# Altium project USB Wi-Fi Radio.PrjPcb
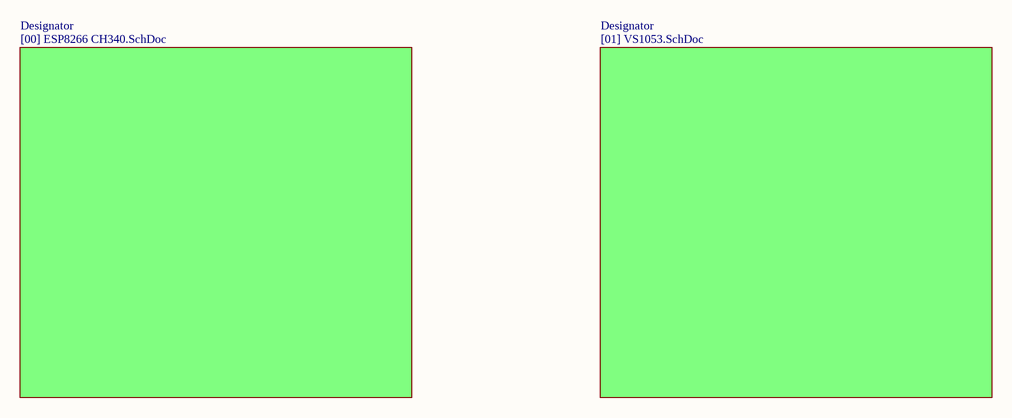
[diagram p0: Wi-Fi Radio.SchDoc]
3 sheets, 80 parts. Net scope: flat (ports and power ports of the same name join across sheets).
Board file: USB Wi-Fi.PcbDoc
Sheets:
  Wi-Fi Radio.SchDoc
    Designator = [00] ESP8266 CH340.SchDoc
    Designator = [01] VS1053.SchDoc

## Sheet Wi-Fi Radio.SchDoc
size A

### Sub-sheets
Designator = [00] ESP8266 CH340.SchDoc: no entries
Designator = [01] VS1053.SchDoc: no entries

## Sheet [00] ESP8266 CH340.SchDoc
size A4
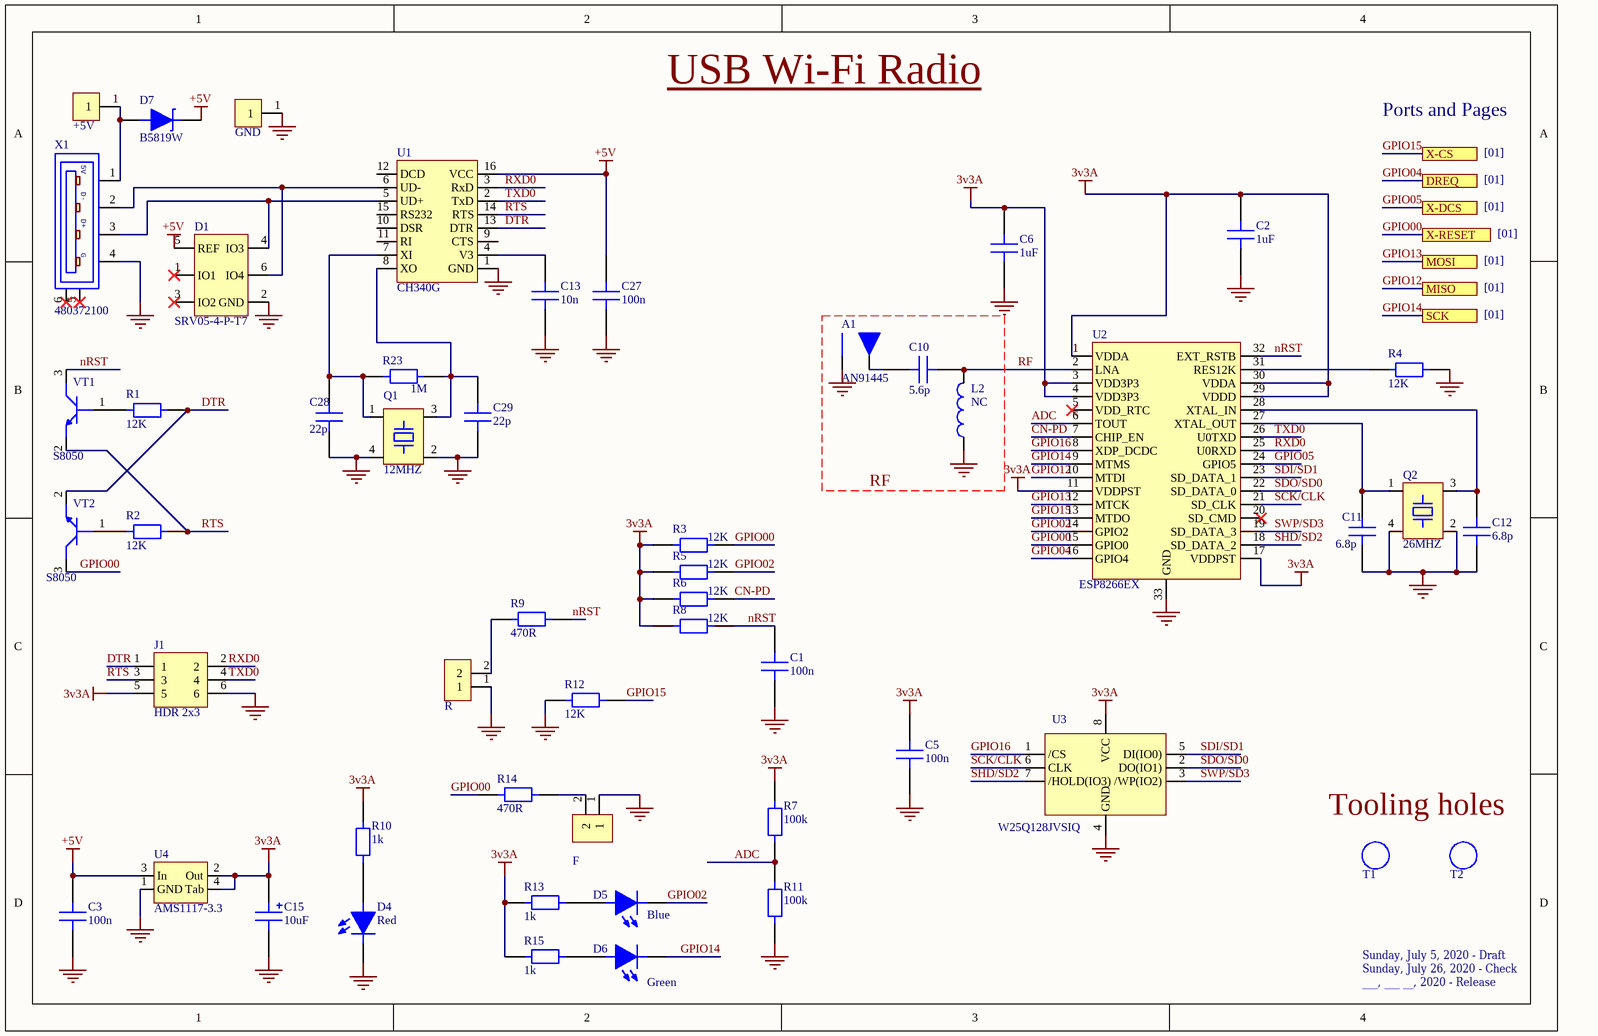
[diagram p1: [00] ESP8266 CH340.SchDoc]

### Parts
A1  AN91445  [MIFA 2.4GHz]  (no BOM)
C1  100n  [0603 CAP]
C2  1uF  [0402]
C3  100n  [0603 CAP]
C5  100n  [0603 CAP]
C6  1uF  [0402]
C10  5.6p  [CAP 0402]
C11  6.8p  [0402]
C12  6.8p  [0402]
C13  10n  [0603 CAP]
C15  10uF  [CAP 1206]
C27  100n  [0603 CAP]
C28  22p  [0603 CAP]
C29  22p  [0603 CAP]
D1  SRV05-4-P-T7  [SOT-23-6]
D4  Red  [LED 0603]
D5  Blue  [LED 0603]
D6  Green  [LED 0603]
D7  B5819W  [SOD-123]
J1  HDR 2x3  [HDR 2x3 2.54mm]
JP1  R  [Hdr_Fem_1x2_2.54mm]
JP2  F  [Hdr_Fem_1x2_2.54mm]
JP3  +5V  [Hdr_Fem_1x1_2.54mm]
JP4  GND  [Hdr_Fem_1x1_2.54mm]
L2  NC  [IND 0402]
Q1  12MHZ  [ABM8W]
Q2  26MHZ  [ABM8W]
R1  12K  [0603 RES]
R2  12K  [0603 RES]
R3  12K  [0603 RES]
R4  12K  [0402 RES]
R5  12K  [0603 RES]
R6  12K  [0603 RES]
R7  100k  [0603 RES]
R8  12K  [0603 RES]
R9  470R  [0603 RES]
R10  1k  [0603 RES]
R11  100k  [0603 RES]
R12  12K  [0603 RES]
R13  1k  [0603 RES]
R14  470R  [0603 RES]
R15  1k  [0603 RES]
R23  1M  [0603 RES]
T1  Tooling hole  [Tooling]  (value not drawn)  (no BOM)
T2  Tooling hole  [Tooling]  (value not drawn)  (no BOM)
U1  CH340G  [SOP-16]
U2  ESP8266EX  [QFN-32 Thermal]
U3  W25Q128JVSIQ  [SOIC-8 208-mil]
U4  AMS1117-3.3  [SOT233-3]
VT1  S8050  [SOT-23]
VT2  S8050  [SOT-23]
X1  480372100  [USB2.0-A]

### Ports
DREQ, MISO, MOSI, SCK, X-CS, X-DCS, X-RESET

### Nets
3v3A: C2.2 C5.1 C6.2 C15.1 J1.5 R3.1 R5.1 R6.1 R7.2 R8.1 R10.2 R13.1 R15.1 U2.1(VDDA) U2.3(VDD3P3) U2.4(VDD3P3) U2.11(VDDPST) U2.17(VDDPST) U2.29(VDDD) U2.30(VDDA) U3.8(VCC) U4.2(Out) U4.4(Tab)
+5V: C3.2 C27.2 D1.5(REF) D7.2(K) U1.16(VCC) U4.3(In)
GND: A1.2 C1.1 C2.1 C3.1 C5.2 C6.1 C11.1 C12.1 C13.1 C15.2 C27.1 C28.1 C29.1 D1.2(GND) D4.2 J1.6 JP1.1 JP2.1 JP4.1 L2.1 Q1.2(GND) Q1.4(GND) Q2.2(GND) Q2.4(GND) R4.2 R11.1 R12.1 U1.1(GND) U2.33(GND) U3.4(GND) U4.1(GND) X1.4(GND)
ADC: R7.1 R11.2 U2.6(TOUT)
CN-PD: R6.2 U2.7(CHIP_EN)
DTR: J1.1 R1.2 U1.13(DTR) VT2.2
GPIO00: R3.2 R14.1 U2.15(GPIO0) VT2.3 ; port X-RESET
GPIO02: D5.2 R5.2 U2.14(GPIO2)
GPIO04: U2.16(GPIO4) ; port DREQ
GPIO05: U2.24(GPIO5) ; port X-DCS
GPIO12: U2.10(MTDI) ; port MISO
GPIO13: U2.12(MTCK) ; port MOSI
GPIO14: D6.2 U2.9(MTMS) ; port SCK
GPIO15: R12.2 U2.13(MTDO) ; port X-CS
GPIO16: U2.8(XDP_DCDC) U3.1(/CS)
nRST: C1.2 R8.2 R9.2 U2.32(EXT_RSTB) VT1.3
RF: C10.2 L2.2 U2.2(LNA)
RTS: J1.3 R2.2 U1.14(RTS) VT1.2
RXD0: J1.2 U1.3(RxD) U2.25(U0RXD)
SCK/CLK: U2.21(SD_CLK) U3.6(CLK)
SDI/SD1: U2.23(SD_DATA_1) U3.5(DI(IO0))
SDO/SD0: U2.22(SD_DATA_0) U3.2(DO(IO1))
SHD/SD2: U2.18(SD_DATA_2) U3.7(/HOLD(IO3))
SWP/SD3: U2.19(SD_DATA_3) U3.3(/WP(IO2))
TXD0: J1.4 U1.2(TxD) U2.26(U0TXD)
NetA1_1: A1.1 C10.1
NetC11_2: C11.2 Q2.1 U2.27(XTAL_OUT)
NetC12_2: C12.2 Q2.3 U2.28(XTAL_IN)
NetC13_2: C13.2 U1.4(V3)
NetC28_2: C28.2 Q1.1 R23.1 U1.7(XI)
NetC29_2: C29.2 Q1.3 R23.2 U1.8(XO)
NetD1_4: D1.4(IO3) U1.5(UD+) X1.3(DX_P)
NetD1_6: D1.6(IO4) U1.6(UD-) X1.2(DX_N)
NetD4_1: D4.1 R10.1
NetD5_1: D5.1 R13.2
NetD6_1: D6.1 R15.2
NetD7_1: D7.1(A) JP3.1 X1.1(5V)
NetJP1_2: JP1.2 R9.1
NetJP2_2: JP2.2 R14.2
NetR1_1: R1.1 VT1.1
NetR2_1: R2.1 VT2.1
NetR4_1: R4.1 U2.31(RES12K)

Not connected (* = marked no-connect by the designer): D1 1(IO1)* 3(IO2)*; U1 9(CTS) 10(DSR) 11(RI) 12(DCD) 15(RS232); U2 5(VDD_RTC)* 20(SD_CMD)*; X1 5* 6*

### Notes on the sheet
- USB-TTL/Autoreset
- USB Wi-Fi Radio
- ESP8266EX
- Ports and Pages
- [01]
- RF
- I/O Bias
- Flash
- Power
- Tooling holes
- Sunday, ‎July ‎26, ‎2020 - Check
- Sunday, ‎July 5, ‎2020 - Draft
- ___, ‎___ ‎__, ‎2020 - Release
- (in symbol 480372100) D-; D+; G

### Library data of the parts
A1 = MIFA 2.4GHz: ComponentLink1Description: rf-layout-guidelines; ComponentLink1URL: https://www.cypress.com/documentation/application-notes/an91445-antenna-design-and-rf-layout-guidelines
C1 C3 C5 C27 = CC0603KRX7R9BB104: MULTILAYER CERAMIC CAPACITORS MLCC - SMD/SMT 100NF 50V 0603 ROHS; Manufacturer: YAGEO; Category: Capacitors; MFR.Part #: CC0603KRX7R9BB104; LCSC Part #: C14663; Package: 0603; Datasheet: https://datasheet.lcsc.com/szlcsc/YAGEO-CC0603KRX7R9BB104_C14663.pdf
C2 C6 = CL05A105KA5NQNC: MULTILAYER CERAMIC CAPACITORS MLCC - SMD/SMT 1UF 25V 0402 ROHS; Manufacturer: Samsung Electro-Mechanics; Category: Capacitors; MFR.Part #: CL05A105KA5NQNC; LCSC Part #: C52923; Package: 0402; Datasheet: https://datasheet.lcsc.com/szlcsc/Samsung-Electro-Mechanics-CL05A105KA5NQNC_C52923.pdf
C10 = CL05B103KB5NNNC_1: 5.6PF ±0.25PF 50V C0G 0402 MULTILAYER CERAMIC CAPACITORS MLCC - SMD/SMT ROHS; Manufacturer: Samsung Electro-Mechanics; MFR.Part #: CL05C5R6CB5NNNC; Library Type: Extended; Category: Capacitors; LCSC Part #: C318596; Package: 0402; Datasheet: https://datasheet.lcsc.com/szlcsc/1811131657_Samsung-Electro-Mechanics-CL05C5R6CB5NNNC_C318596.pdf; ComponentLink1Description: CL05C5R6CB5NNNC_C318596.pdf; ComponentLink1URL: https://datasheet.lcsc.com/szlcsc/1811131657_Samsung-Electro-Mechanics-CL05C5R6CB5NNNC_C318596.pdf
C11 C12 = 0402CG6R8C500NT: MULTILAYER CERAMIC CAPACITORS MLCC - SMD/SMT 6.8PF 50V 0402 ROHS; Manufacturer: Guangdong Fenghua Advanced Tech; Category: Capacitors; MFR.Part #: 0402CG6R8C500NT; LCSC Part #: C1576; Package: 0402; Datasheet: https://datasheet.lcsc.com/szlcsc/Guangdong-Fenghua-Advanced-Tech-0402CG6R8C500NT_C1576.pdf
C13 = 0603B103K500NT: MULTILAYER CERAMIC CAPACITORS MLCC - SMD/SMT 10NF 50V 0603 ROHS; Manufacturer: Guangdong Fenghua Advanced Tech; Category: Capacitors; MFR.Part #: 0603B103K500NT; LCSC Part #: C57112; Package: 0603; Datasheet: https://datasheet.lcsc.com/szlcsc/Guangdong-Fenghua-Advanced-Tech-0603B103K500NT_C57112.pdf
C15 = TAJA106K016RNJ: TANTALUM CAPACITORS 10UF 16V CASE-A_3216 ROHS; Manufacturer: AVX; Category: Capacitors; MFR.Part #: TAJA106K016RNJ; LCSC Part #: C7171; Package: CASE-A_3216; Datasheet: https://datasheet.lcsc.com/szlcsc/AVX-TAJA106K016RNJ_C7171.pdf
C28 C29 = CL10C220JB8NNNC: MULTILAYER CERAMIC CAPACITORS MLCC - SMD/SMT 22PF 50V 0603 ROHS; Manufacturer: Samsung Electro-Mechanics; Category: Capacitors; MFR.Part #: CL10C220JB8NNNC; LCSC Part #: C1653; Package: 0603; Datasheet: https://datasheet.lcsc.com/szlcsc/Samsung-Electro-Mechanics-CL10C220JB8NNNC_C1653.pdf
D1 = SRV05-4-P-T7: TVS SOT-23-6 ROHS; Manufacturer: ProTek Devices; Category: Diodes; MFR.Part #: SRV05-4-P-T7; LCSC Part #: C85364; Package: SOT-23-6L; Datasheet: https://datasheet.lcsc.com/szlcsc/ProTek-Devices-SRV05-4-P-T7_C85364.pdf; ComponentLink1Description: SRV05-4-P-T7_C85364; ComponentLink1URL: https://datasheet.lcsc.com/szlcsc/ProTek-Devices-SRV05-4-P-T7_C85364.pdf
D4 = KT-0603R: LIGHT EMITTING DIODES (LED) RED 520~625NM 90~100MCD@20MA TOP VIEW 0603 ROHS; Manufacturer: Hubei KENTO Elec; Category: LED's; MFR.Part #: KT-0603R; LCSC Part #: C2286; Package: LED_0603; Datasheet: https://datasheet.lcsc.com/szlcsc/Hubei-KENTO-Elec-KT-0603R_C2286.pdf
D5 = 19-217/BHC-ZL1M2RY/3T: LIGHT EMITTING DIODES (LED) BLUE 465~475NM 11.5~28.5MCD@5MA TOP VIEW 0603 ROHS; Manufacturer: Everlight Elec; Category: LED's; MFR.Part #: 19-217/BHC-ZL1M2RY/3T; LCSC Part #: C72041; Package: LED_0603; Datasheet: https://datasheet.lcsc.com/szlcsc/Everlight-Elec-19-217-BHC-ZL1M2RY-3T_C72041.pdf
D6 = 19-217/GHC-YR1S2/3T: LIGHT EMITTING DIODES (LED) GREEN 520~535NM 112~258MCD@20MA TOP VIEW 0603 ROHS; Manufacturer: Everlight Elec; Category: LED's; MFR.Part #: 19-217/GHC-YR1S2/3T; LCSC Part #: C72043; Package: LED_0603; Datasheet: https://datasheet.lcsc.com/szlcsc/Everlight-Elec-19-217-GHC-YR1S2-3T_C72043.pdf
D7 = B5819W: SCHOTTKY BARRIER DIODES (SBD) SOD-123 ROHS; Manufacturer: Changjiang Electronics Tech (CJ); Category: Diodes; MFR.Part #: B5819W; LCSC Part #: C8598; Package: SOD-123; Datasheet: https://datasheet.lcsc.com/szlcsc/Changjiang-Electronics-Tech-CJ-B5819W_C8598.pdf
J1 = 67997-106HLF: CONN HEADER 6POS .100 STR 30AU; Manufacturer 1: Amphenol FCI; Number of Contacts: 6; Insulation Resistance: 5GR; Max Voltage Rating (AC): 1.5kV; Gender: Male; Current Rating: 3A; Connector Type: Male Pin; Pitch: 2.54mm; Row Spacing: 0.1inch; Contact Post Length: 3.05mm; Supplier 1: Digi-Key; Manufacturer Part Number 1: 67997-106HLF; RoHS: Yes; Category: Headers and Wire Housings; Stock 1: 1665; Pricing 1: 1=1.78000, 10=1.61400, 100=1.38370, 500=1.15308, 1000=0.98835, 5000=0.87634, 10000=0.85657 (USD); Mount: Through Hole; Contact Plating: Gold,GXT; Housing Color: Black; Contact Material: Bronze; Color: Black; Housing Material: Thermoplastic; Min Operating Temperature: -65°C; Max Operating Temperature: 125°C; Termination: Through Hole; Number of Rows: 2; Orientation: Straight; Number of Positions: 6; Packaging: Bulk; Package Quantity: 100; Contact Gender: Male; Voltage Rating: 1.5kV; Length: 7.62mm; Contact Mating Length: 0.23inch; Depth: 4.83mm; Radiation Hardening: No; Lead Free: Lead Free; REACH SVHC: No SVHC; Flammability Rating: UL94 V-0; ComponentLink1URL: https://datasheet.ciiva.com/5153/67996-222463-5153820.pdf?src-supplier=Mouser; ComponentLink1Description: https://datasheet.ciiva.com/5153/67996-222463-5153820.pdf?src-supplier=Mouser; ComponentLink2URL: https://datasheet.ciiva.com/16726/67996-16726286.pdf?src-supplier=Avnet+Europe; ComponentLink2Description: https://datasheet.ciiva.com/16726/67996-16726286.pdf?src-supplier=Avnet+Europe; ComponentLink3URL: https://datasheet.ciiva.com/722/67996-722044.pdf?src-supplier=Digi-Key; ComponentLink3Description: https://datasheet.ciiva.com/722/67996-722044.pdf?src-supplier=Digi-Key; ComponentLink4URL: https://datasheet.ciiva.com/10149/67996-10149221.pdf?src-supplier=Avnet; ComponentLink4Description: https://datasheet.ciiva.com/10149/67996-10149221.pdf?src-supplier=Avnet; ComponentLink5URL: https://datasheet.ciiva.com/46393/1876884-46393067.pdf?src-supplier=Element14; ComponentLink5Description: https://datasheet.ciiva.com/46393/1876884-46393067.pdf?src-supplier=Element14; Supplier Part Number 1: 609-3393-ND
JP1 JP2 = 68602-204HLF: CONN HEADER VERT 2POS 2.54MM; Manufacturer 1: Amphenol FCI; Gender: Male; Connector Type: Male Pin; Number of Positions: 4; Insulation Resistance: 5GR; Current Rating: 3A; Voltage Rating: 1.5kV; Row Spacing: 0.1inch; Contact Post Length: 3.81mm; Supplier 1: Digi-Key; Manufacturer Part Number 1: 68602-204HLF; RoHS: Yes; Category: Headers and Wire Housings; Stock 1: 139; Pricing 1: 1=0.34000, 10=0.31900, 100=0.22320, 500=0.19132, 1000=0.15943, 5000=0.13665, 10000=0.12754 (USD); Mount: Through Hole; Housing Material: Thermoplastic; Contact Plating: Gold,GXT; Color: Black; Contact Material: Bronze; Min Operating Temperature: -65°C; Max Operating Temperature: 125°C; Termination: Solder; Packaging: Bulk; Number of Rows: 2; Number of Contacts: 4; Package Quantity: 100; Contact Gender: Male; Pitch: 2.54mm; Contact Mating Length: 0.23inch; Radiation Hardening: No; Flammability Rating: UL94 V-0; ComponentLink1URL: https://datasheet.ciiva.com/728/67996-728884.pdf?src-supplier=Digi-Key; ComponentLink1Description: https://datasheet.ciiva.com/728/67996-728884.pdf?src-supplier=Digi-Key; Supplier Part Number 1: 609-3369-ND
JP3 JP4 = 68602-101HLF: CONN HEADER VERT 1POS 2.54MM; Manufacturer 1: Amphenol FCI; Manufacturer Part Number 1: 68602-204HLF; Gender: Male; Connector Type: Male Pin; Number of Positions: 4; Insulation Resistance: 5GR; Current Rating: 3A; Voltage Rating: 1.5kV; Row Spacing: 0.1inch; Contact Post Length: 3.81mm; Supplier 1: Digi-Key; RoHS: Yes; Category: Headers and Wire Housings; Stock 1: 139; Pricing 1: 1=0.34000, 10=0.31900, 100=0.22320, 500=0.19132, 1000=0.15943, 5000=0.13665, 10000=0.12754 (USD); Mount: Through Hole; Housing Material: Thermoplastic; Contact Plating: Gold,GXT; Color: Black; Contact Material: Bronze; Min Operating Temperature: -65°C; Max Operating Temperature: 125°C; Termination: Solder; Packaging: Bulk; Number of Rows: 2; Number of Contacts: 4; Package Quantity: 100; Contact Gender: Male; Pitch: 2.54mm; Contact Mating Length: 0.23inch; Radiation Hardening: No; Flammability Rating: UL94 V-0; ComponentLink1URL: https://datasheet.ciiva.com/728/67996-728884.pdf?src-supplier=Digi-Key; ComponentLink1Description: https://datasheet.ciiva.com/728/67996-728884.pdf?src-supplier=Digi-Key; Supplier Part Number 1: 609-3369-ND
L2 = NC IND: IND 0402 Matching
Q1 = X322512MSB4SI: SMD CRYSTAL RESONATORS 12MHZ ±10PPM SMD-3225_4P ROHS; Manufacturer: Yangxing Tech; Category: Crystals; MFR.Part #: X322512MSB4SI; LCSC Part #: C9002; Package: SMD-3225_4P; Datasheet: https://datasheet.lcsc.com/szlcsc/Yangxing-Tech-X322512MSB4SI_C9002.pdf; ComponentLink1Description: X322512MSB4SI_C9002.pdf; ComponentLink1URL: https://datasheet.lcsc.com/szlcsc/Yangxing-Tech-X322512MSB4SI_C9002.pdf
Q2 = X322526MEB4SC: SMD CRYSTAL RESONATORS 26MHZ ±10PPM SMD-3225_4P ROHS; Manufacturer: Yangxing Tech; Category: Crystals; MFR.Part #: X322526MEB4SC; LCSC Part #: C23425; Package: SMD-3225_4P; Datasheet: https://datasheet.lcsc.com/szlcsc/Yangxing-Tech-X322526MEB4SC_C23425.pdf
R1-R3 R5 R6 R8 R12 = 0603WAF1202T5E: CHIP RESISTOR - SURFACE MOUNT 12KOHMS ±1% 1/10W 0603 ROHS; Manufacturer: Uniroyal Elec; Category: Resistors; MFR.Part #: 0603WAF1202T5E; LCSC Part #: C22790; Package: 0603; Datasheet: https://datasheet.lcsc.com/szlcsc/Uniroyal-Elec-0603WAF1202T5E_C22790.pdf
R4 = 0402WGF1202TCE: CHIP RESISTOR - SURFACE MOUNT 12KOHMS ±1% 1/16W 0402 ROHS; Manufacturer: Uniroyal Elec; Category: Resistors; MFR.Part #: 0402WGF1202TCE; LCSC Part #: C25752; Package: 0402; Datasheet: https://datasheet.lcsc.com/szlcsc/Uniroyal-Elec-0402WGF1202TCE_C25752.pdf
R7 R11 = 0603WAF1003T5E: CHIP RESISTOR - SURFACE MOUNT 100KOHMS ±1% 1/10W 0603 ROHS; Manufacturer: Uniroyal Elec; Category: Resistors; MFR.Part #: 0603WAF1003T5E; LCSC Part #: C25803; Package: 0603; Datasheet: https://datasheet.lcsc.com/szlcsc/Uniroyal-Elec-0603WAF1003T5E_C25803.pdf
R9 R14 = 0603WAF4700T5E: CHIP RESISTOR - SURFACE MOUNT 470OHMS ±1% 1/10W 0603 ROHS; Manufacturer: Uniroyal Elec; Category: Resistors; MFR.Part #: 0603WAF4700T5E; LCSC Part #: C23179; Package: 0603; Datasheet: https://datasheet.lcsc.com/szlcsc/Uniroyal-Elec-0603WAF4700T5E_C23179.pdf
R10 R13 R15 = 0603WAF1001T5E: CHIP RESISTOR - SURFACE MOUNT 1KOHMS ±1% 1/10W 0603 ROHS; Manufacturer: Uniroyal Elec; Category: Resistors; MFR.Part #: 0603WAF1001T5E; LCSC Part #: C21190; Package: 0603; Datasheet: https://datasheet.lcsc.com/szlcsc/Uniroyal-Elec-0603WAF1001T5E_C21190.pdf
R23 = 0603WAF1004T5E: CHIP RESISTOR - SURFACE MOUNT 1MOHMS ±1% 1/10W 0603 ROHS; Manufacturer: Uniroyal Elec; Category: Resistors; MFR.Part #: 0603WAF1004T5E; LCSC Part #: C22935; Package: 0603; Datasheet: https://datasheet.lcsc.com/szlcsc/Uniroyal-Elec-0603WAF1004T5E_C22935.pdf
T1 T2 = Tooling hole: For JLCPCB SMT Assembly
U1 = CH340G: USB 2MBPS 3.3V, 5V SOP-16_150MIL ROHS; Manufacturer: Jiangsu Qin Heng; Category: IC's; MFR.Part #: CH340G; LCSC Part #: C14267; Package: SOIC-16_3.9x9.9x1.27P; Datasheet: https://datasheet.lcsc.com/szlcsc/Jiangsu-Qin-Heng-CH340G_C14267.pdf
U2 = ESP8266EX: RF TRANSCEIVER ICS TXRX + MCU WIFI 802.11B/G/N/E/I 2.4GHZ 16DBM - 91DBM 2.5V~3.6V QFN-32_5X5X05P ROHS; Manufacturer: Espressif Systems; Library Type: Extended; Category: IC's; MFR.Part #: ESP8266EX; LCSC Part #: C77967; Package: QFN-32_EP_5.0x5.0x0.5P; Datasheet: https://datasheet.lcsc.com/szlcsc/Espressif-Systems-ESP8266EX_C77967.pdf
U3 = W25Q128JVSIQ: FLASH FLASH 128MB (16M X 8) SPI - DUAL/QUAD I/O SOIC-8_208MIL ROHS; Manufacturer: Winbond Elec; Category: IC's; MFR.Part #: W25Q128JVSIQ; LCSC Part #: C97521; Package: SOIC-8_5.3x5.3x1.27P; Datasheet: https://datasheet.lcsc.com/szlcsc/Winbond-Elec-W25Q128JVSIQTR_C97521.pdf
U4 = AMS1117-3.3: LOW DROPOUT REGULATORS(LDO) POSITIVE FIXED 1.3V @ 800MA 15V 3.3V 1A SOT-223 ROHS; Manufacturer: Advanced Monolithic Systems; Category: IC's; MFR.Part #: AMS1117-3.3; LCSC Part #: C6186; Package: SOT-223; Datasheet: https://datasheet.lcsc.com/szlcsc/1811201117_Advanced-Monolithic-Systems-AMS-AMS1117-3-3_C6186.pdf; ComponentLink1Description: AMS1117-3-3_C6186; ComponentLink1URL: https://datasheet.lcsc.com/szlcsc/1811201117_Advanced-Monolithic-Systems-AMS-AMS1117-3-3_C6186.pdf
VT1 VT2 = S8050: TRANSISTORS (NPN/PNP) NPN 500MA 25V SOT-23(SOT-23-3) ROHS; Manufacturer: Changjiang Electronics Tech (CJ); Category: Transistors; MFR.Part #: S8050; LCSC Part #: C2146; Package: SOT-23-3; Datasheet: https://datasheet.lcsc.com/szlcsc/Changjiang-Electronics-Tech-CJ-S8050_C2146.pdf
X1 = 480372100: USB - Type A Male USB 2 4 Through Hole USB Connectors RoHS; Manufacturer: MOLEX; Category: Connectors; MFR.Part #: 480372100; LCSC Part #: C136453; Package: Through Hole; Datasheet: https://datasheet.lcsc.com/szlcsc/1811131824_MOLEX-480372100_C136453.pdf

## Sheet [01] VS1053.SchDoc
size A4
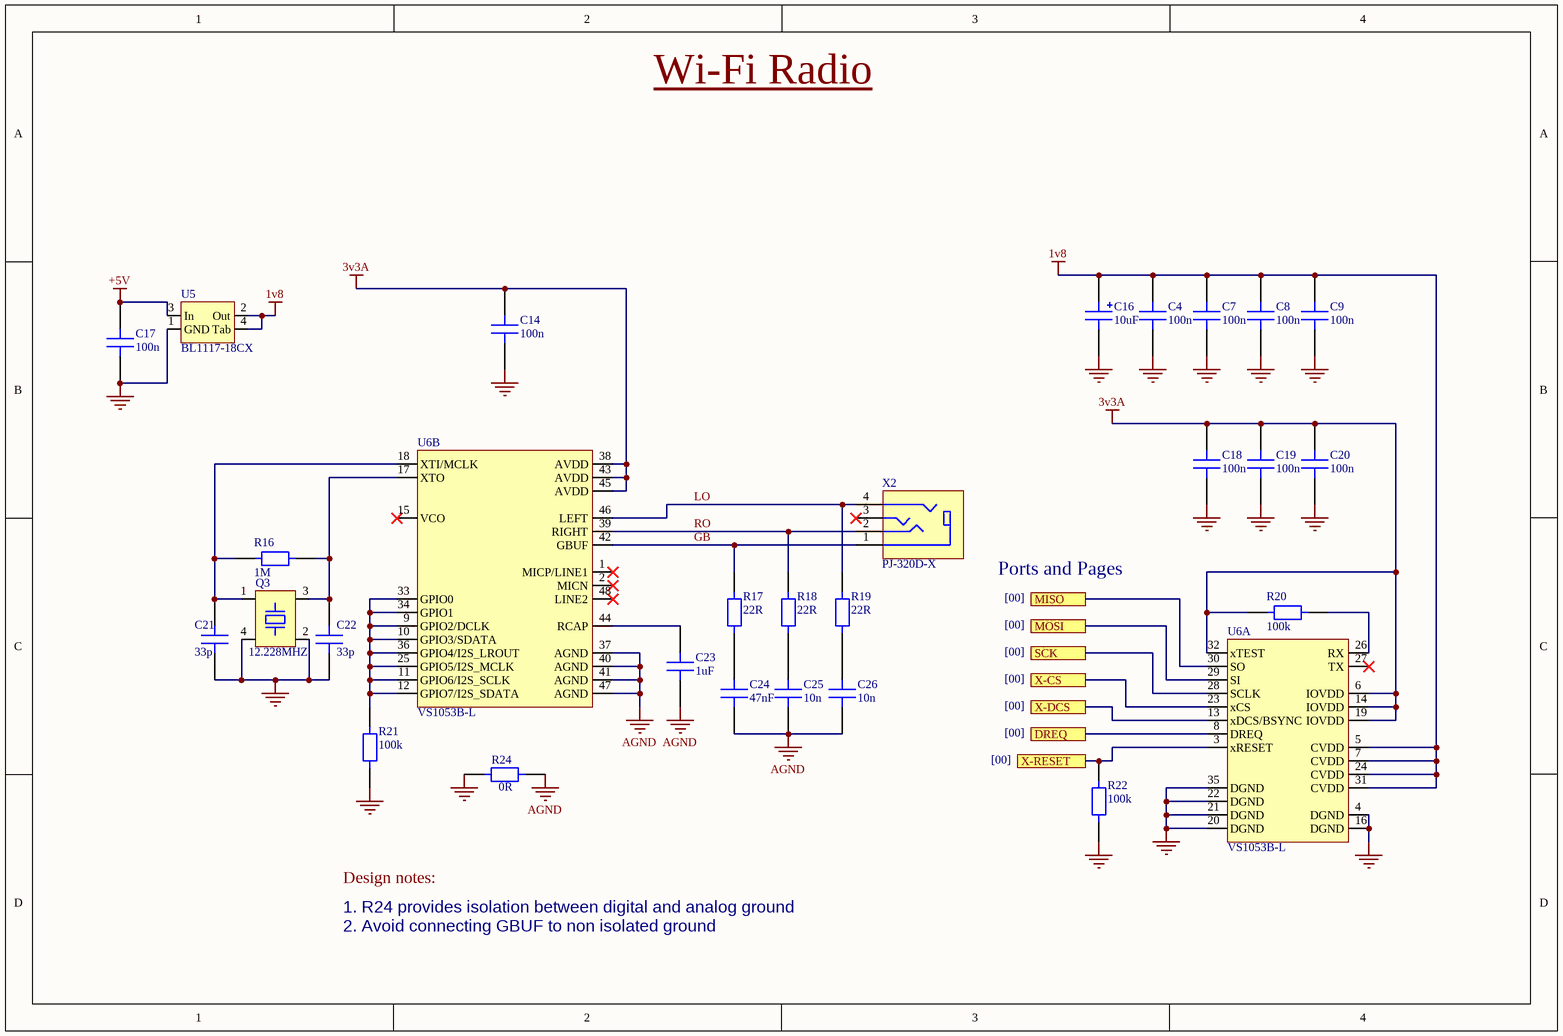
[diagram p2: [01] VS1053.SchDoc]

### Parts
C4  100n  [0603 CAP]
C7  100n  [0603 CAP]
C8  100n  [0603 CAP]
C9  100n  [0603 CAP]
C14  100n  [0603 CAP]
C16  10uF  [CAP 1206]
C17  100n  [0603 CAP]
C18  100n  [0603 CAP]
C19  100n  [0603 CAP]
C20  100n  [0603 CAP]
C21  33p  [0603 CAP]
C22  33p  [0603 CAP]
C23  1uF  [0603 CAP]
C24  47nF  [0603 CAP]
C25  10n  [0603 CAP]
C26  10n  [0603 CAP]
Q3  12.228MHZ  [ABM8W]
R16  1M  [0603 RES]
R17  22R  [0603 RES]
R18  22R  [0603 RES]
R19  22R  [0603 RES]
R20  100k  [0603 RES]
R21  100k  [0603 RES]
R22  100k  [0603 RES]
R24  0R  [0603 RES]
U5  BL1117-18CX  [SOT233-3]
U6  VS1053B-L  [LQFP-48]  (parts A,B of 2)
X2  PJ-320D-X  [3.5mm Jack]

### Ports
DREQ, MISO, MOSI, SCK, X-CS, X-DCS, X-RESET

### Nets
1v8: C4.2 C7.2 C8.2 C9.2 C16.1 U5.2(Out) U5.4(Tab) U6.5(CVDD) U6.7(CVDD) U6.24(CVDD) U6.31(CVDD)
3v3A: C14.2 C18.2 C19.2 C20.2 R20.2 U6.6(IOVDD) U6.14(IOVDD) U6.19(IOVDD) U6.32(xTEST) U6.38(AVDD) U6.43(AVDD) U6.45(AVDD)
+5V: C17.2 U5.3(In)
AGND: C23.1 C24.1 C25.1 C26.1 R24.2 U6.37(AGND) U6.40(AGND) U6.41(AGND) U6.47(AGND)
GND: C4.1 C7.1 C8.1 C9.1 C14.1 C16.2 C17.1 C18.1 C19.1 C20.1 C21.1 C22.1 Q3.2(GND) Q3.4(GND) R21.1 R22.1 R24.1 U5.1(GND) U6.4(DGND) U6.16(DGND) U6.20(DGND) U6.21(DGND) U6.22(DGND) U6.35(DGND)
GB: R17.2 U6.42(GBUF) X2.1
GPIO00: R22.2 U6.3(xRESET) ; port X-RESET
GPIO04: U6.8(DREQ) ; port DREQ
GPIO05: U6.13(xDCS/BSYNC) ; port X-DCS
GPIO12: U6.30(SO) ; port MISO
GPIO13: U6.29(SI) ; port MOSI
GPIO14: U6.28(SCLK) ; port SCK
GPIO15: U6.23(xCS) ; port X-CS
LO: R19.2 U6.46(LEFT) X2.4
RO: R18.2 U6.39(RIGHT) X2.2
NetC21_2: C21.2 Q3.1 R16.1 U6.18(XTI/MCLK)
NetC22_2: C22.2 Q3.3 R16.2 U6.17(XTO)
NetC23_2: C23.2 U6.44(RCAP)
NetC24_2: C24.2 R17.1
NetC25_2: C25.2 R18.1
NetC26_2: C26.2 R19.1
NetR20_1: R20.1 U6.26(RX)
NetR21_2: R21.2 U6.9(GPIO2/DCLK) U6.10(GPIO3/SDATA) U6.11(GPIO6/I2S_SCLK) U6.12(GPIO7/I2S_SDATA) U6.25(GPIO5/I2S_MCLK) U6.33(GPIO0) U6.34(GPIO1) U6.36(GPIO4/I2S_LROUT)

Not connected (* = marked no-connect by the designer): U6 1(MICP/LINE1)* 2(MICN)* 15(VCO)* 27(TX)* 48(LINE2)*; X2 3*

### Notes on the sheet
- Wi-Fi Radio
- Power
- VS1053B MP3 Decoder
- Ports and Pages
- [00]
- Design notes:
- 1. R24 provides isolation between digital and analog ground
  2. Avoid connecting GBUF to non isolated ground

### Library data of the parts
C4 C7-C9 C14 C17-C20 = CC0603KRX7R9BB104: as C1 on sheet [00] ESP8266 CH340; Category: Capacitors; MFR.Part #: CC0603KRX7R9BB104; LCSC Part #: C14663; Package: 0603; Datasheet: https://datasheet.lcsc.com/szlcsc/YAGEO-CC0603KRX7R9BB104_C14663.pdf
C16 = TAJA106K016RNJ: as C15 on sheet [00] ESP8266 CH340; Category: Capacitors; MFR.Part #: TAJA106K016RNJ; LCSC Part #: C7171; Package: CASE-A_3216; Datasheet: https://datasheet.lcsc.com/szlcsc/AVX-TAJA106K016RNJ_C7171.pdf
C21 C22 = CL10C330JB8NNNC: MULTILAYER CERAMIC CAPACITORS MLCC - SMD/SMT 33PF 50V 0603 ROHS; Manufacturer: Samsung Electro-Mechanics; Category: Capacitors; MFR.Part #: CL10C330JB8NNNC; LCSC Part #: C1663; Package: 0603; Datasheet: https://datasheet.lcsc.com/szlcsc/Samsung-Electro-Mechanics-CL10C330JB8NNNC_C1663.pdf
C23 = CL10A105KB8NNNC: MULTILAYER CERAMIC CAPACITORS MLCC - SMD/SMT 1UF 50V 0603 ROHS; Manufacturer: Samsung Electro-Mechanics; Category: Capacitors; MFR.Part #: CL10A105KB8NNNC; LCSC Part #: C15849; Package: 0603; Datasheet: https://datasheet.lcsc.com/szlcsc/Samsung-Electro-Mechanics-CL10A105KB8NNNC_C15849.pdf
C24 = CL10B473KB8NNNC: MULTILAYER CERAMIC CAPACITORS MLCC - SMD/SMT 47NF 50V 0603 ROHS; Manufacturer: Samsung Electro-Mechanics; Category: Capacitors; MFR.Part #: CL10B473KB8NNNC; LCSC Part #: C1622; Package: 0603; Datasheet: https://datasheet.lcsc.com/szlcsc/Samsung-Electro-Mechanics-CL10B473KB8NNNC_C1622.pdf
C25 C26 = 0603B103K500NT: as C13 on sheet [00] ESP8266 CH340; Category: Capacitors; MFR.Part #: 0603B103K500NT; LCSC Part #: C57112; Package: 0603; Datasheet: https://datasheet.lcsc.com/szlcsc/Guangdong-Fenghua-Advanced-Tech-0603B103K500NT_C57112.pdf
Q3 = X322512288MOB4SC: SMD CRYSTAL RESONATORS 12.288MHZ ±10PPM SMD-3225_4P ROHS; Manufacturer: Yangxing Tech; Category: Crystals; MFR.Part #: X322512288MOB4SC; LCSC Part #: C70567; Package: SMD-3225_4P; Datasheet: https://datasheet.lcsc.com/szlcsc/LCSC-X322512288MOB4SC_C70567.pdf
R16 = 0603WAF1004T5E: as R23 on sheet [00] ESP8266 CH340; Category: Resistors; MFR.Part #: 0603WAF1004T5E; LCSC Part #: C22935; Package: 0603; Datasheet: https://datasheet.lcsc.com/szlcsc/Uniroyal-Elec-0603WAF1004T5E_C22935.pdf
R17-R19 = 0603WAF220JT5E: CHIP RESISTOR - SURFACE MOUNT 22OHMS ±1% 1/10W 0603 ROHS; Manufacturer: Uniroyal Elec; Category: Resistors; MFR.Part #: 0603WAF220JT5E; LCSC Part #: C23345; Package: 0603; Datasheet: https://datasheet.lcsc.com/szlcsc/Uniroyal-Elec-0603WAF220JT5E_C23345.pdf
R20-R22 = 0603WAF1003T5E: as R7 on sheet [00] ESP8266 CH340; Category: Resistors; MFR.Part #: 0603WAF1003T5E; LCSC Part #: C25803; Package: 0603; Datasheet: https://datasheet.lcsc.com/szlcsc/Uniroyal-Elec-0603WAF1003T5E_C25803.pdf
R24 = 0603WAF0000T5E: CHIP RESISTOR - SURFACE MOUNT 0OHMS ±1% 1/10W 0603 ROHS; Manufacturer: Uniroyal Elec; Category: Resistors; MFR.Part #: 0603WAF0000T5E; LCSC Part #: C21189; Package: 0603; Datasheet: https://datasheet.lcsc.com/szlcsc/Uniroyal-Elec-0603WAF0000T5E_C21189.pdf
U5 = BL1117-18CX: LOW DROPOUT REGULATORS(LDO) POSITIVE FIXED 1.5V @ 1A 12V 1.8V 1A SOT-223 ROHS; Manufacturer: Shanghai Belling; Library Type: Extended; Category: IC's; MFR.Part #: BL1117-18CX; LCSC Part #: C78971; Package: SOT-223; Datasheet: https://datasheet.lcsc.com/szlcsc/Shanghai-Belling-BL1117-18CX_C78971.pdf
U6 = VS1053B-L: VIDEO-AUDIO INTERFACE ICS LQFP-48_7X7X05P ROHS; Manufacturer: VLSI Solution; Library Type: Extended; Category: IC's; MFR.Part #: VS1053B-L; LCSC Part #: C9922; Package: LQFP-48_7.0x7.0x0.5P; Datasheet: https://datasheet.lcsc.com/szlcsc/VLSI-Solution-VS1053B_C9922.pdf
X2 = PJ-320D-X: 3.5mm SMD Headphone Holder 4 Female Horizontal SMD Audio & Video Connectors RoHS; Manufacturer: XKB Enterprise; Category: Connectors; MFR.Part #: PJ-320D-X; LCSC Part #: C319111; Package: SMD; Datasheet: https://datasheet.lcsc.com/szlcsc/1810301445_XKB-Enterprise-PJ-320D-X_C319111.pdf; ComponentLink1Description: PJ-320D-X; ComponentLink1URL: https://datasheet.lcsc.com/szlcsc/1810301445_XKB-Enterprise-PJ-320D-X_C319111.pdf

## Nets that join several sheets
3v3A: [00] ESP8266 CH340 (23 pins), [01] VS1053 (12 pins)
+5V: [00] ESP8266 CH340 (6 pins), [01] VS1053 (C17.2 U5.3)
GND: [00] ESP8266 CH340 (32 pins), [01] VS1053 (24 pins)
GPIO00: [00] ESP8266 CH340 (R3.2 R14.1 U2.15 VT2.3), [01] VS1053 (R22.2 U6.3)
GPIO04: [00] ESP8266 CH340 (U2.16), [01] VS1053 (U6.8)
GPIO05: [00] ESP8266 CH340 (U2.24), [01] VS1053 (U6.13)
GPIO12: [00] ESP8266 CH340 (U2.10), [01] VS1053 (U6.30)
GPIO13: [00] ESP8266 CH340 (U2.12), [01] VS1053 (U6.29)
GPIO14: [00] ESP8266 CH340 (D6.2 U2.9), [01] VS1053 (U6.28)
GPIO15: [00] ESP8266 CH340 (R12.2 U2.13), [01] VS1053 (U6.23)

## Assembly variants
SMT: not fitted A1 C10 C13 C27 C28 C29 J1 JP1 JP2 JP3 JP4 L2 Q1 R23 U1 U3 U5 X1 X2